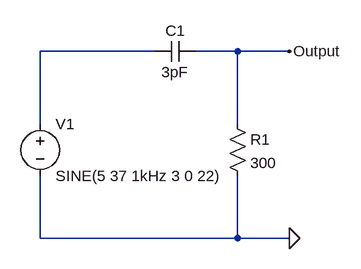
[diagram p0: schematic rc_differentiator.asc]
rc_differentiator.asc, the LTspice schematic file:
Version 4
SHEET 1 880 680
WIRE 304 208 128 208
WIRE 432 208 368 208
WIRE 512 208 432 208
WIRE 128 320 128 208
WIRE 432 320 432 208
WIRE 128 496 128 400
WIRE 432 496 432 400
WIRE 432 496 128 496
WIRE 512 496 432 496
FLAG 512 208 Output
FLAG 512 496 0
SYMBOL voltage 128 304 R0
SYMATTR InstName V1
SYMATTR Value SINE(5 37 1kHz 3 0 22)
SYMBOL cap 368 192 R90
WINDOW 0 0 32 VBottom 2
WINDOW 3 32 32 VTop 2
SYMATTR InstName C1
SYMATTR Value 3pF
SYMBOL res 416 304 R0
SYMATTR InstName R1
SYMATTR Value 300

The netlist it stands for:
* rc_differentiator.asc
V1 N001 0 SINE(5 37 1kHz 3 0 22)
C1 Output N001 3pF
R1 Output 0 300
.backanno
.end